# EAGLE design NESv21 (EAGLE 5.11)
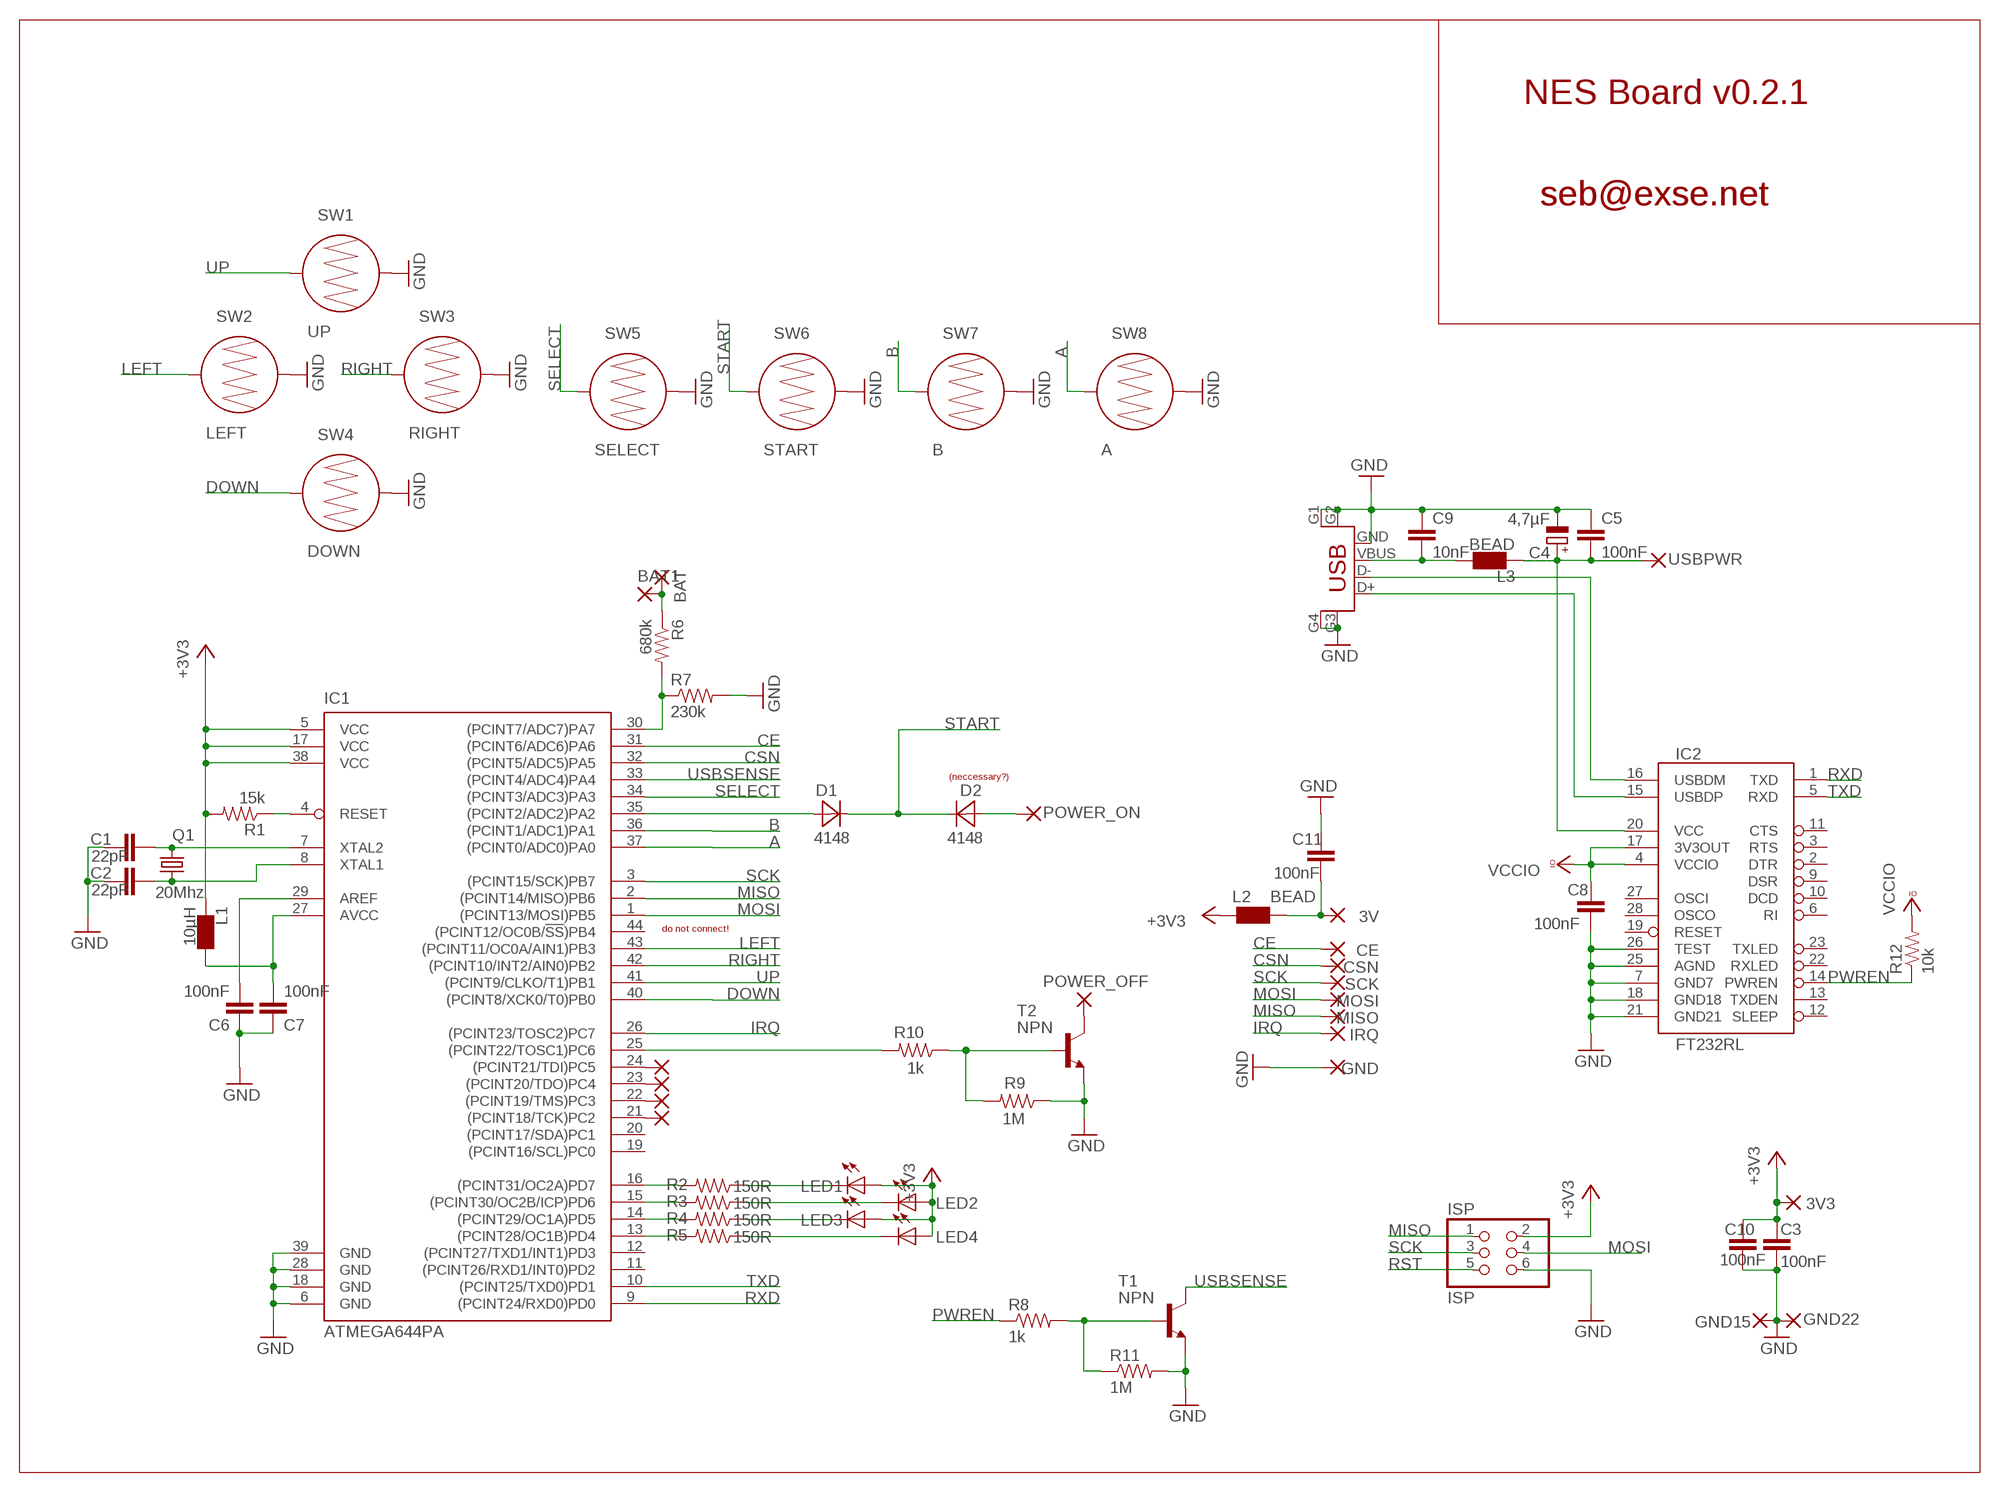
[diagram p0: schematic, sheet 1]

## Parts
3V  SMD2  [SMD1,27-2,54]
3V3  SMD2  [SMD1,27-2,54]
BAT  SMD2  [SMD1,27-2,54]
BAT1  SMD2  [SMD1,27-2,54]
C1  22pF  CAP0805  [0805]
C2  22pF  CAP0805  [0805]
C3  100nF  CAP0805  [0805]
C4  4,7µF  CPOL-EUSMCC  [SMC_C]
C5  100nF  CAP0805  [0805]
C6  100nF  CAP0805  [0805]
C7  100nF  CAP0805  [0805]
C8  100nF  CAP0805  [0805]
C9  10nF  CAP0805  [0805]
C10  100nF  CAP0805  [0805]
C11  100nF  CAP0805  [0805]
CE  SMD2  [SMD1,27-2,54]
CSN  SMD2  [SMD1,27-2,54]
D1  4148  DIODE_0805  [DIODE_0805]
D2  4148  DIODE_0805  [DIODE_0805]
GND  SMD2  [SMD1,27-2,54]
GND15  SMD2  [SMD1,27-2,54]
GND22  SMD2  [SMD1,27-2,54]
IC1  ATMEGA644PA  [TQFP44]
IC2  FT232RL  FT232RLSSOP  [SSOP28DB]
IRQ  SMD2  [SMD1,27-2,54]
ISP  ISP  PINHD-2X03_2.54  [2X03]
L1  10µH  L0805  [0805]
L2  BEAD  [0805]
L3  BEAD  [0805]
LED1  LED3MM  [LED3MM]
LED2  LED3MM  [LED3MM]
LED3  LED3MM  [LED3MM]
LED4  LED3MM  [LED3MM]
MISO  SMD2  [SMD1,27-2,54]
MOSI  SMD2  [SMD1,27-2,54]
PAD1  SMD2  [SMD1,27-2,54]
PAD2  SMD2  [SMD1,27-2,54]
PAD3  SMD2  [SMD1,27-2,54]
PAD4  SMD2  [SMD1,27-2,54]
POWER_OFF  SMD2  [SMD1,27-2,54]
POWER_ON  SMD2  [SMD1,27-2,54]
Q1  20Mhz  X22-OSCILLATOR  [X22]
R1  15k  RESISTOR0805-RES  [0805]
R2  150R  RESISTOR0805-RES  [0805]
R3  150R  RESISTOR0805-RES  [0805]
R4  150R  RESISTOR0805-RES  [0805]
R5  150R  RESISTOR0805-RES  [0805]
R6  680k  RESISTOR0805-RES  [0805]
R7  230k  RESISTOR0805-RES  [0805]
R8  1k  RESISTOR0805-RES  [0805]
R9  1M  RESISTOR0805-RES  [0805]
R10  1k  RESISTOR0805-RES  [0805]
R11  1M  RESISTOR0805-RES  [0805]
R12  10k  RESISTOR0805-RES  [0805]
SCK  SMD2  [SMD1,27-2,54]
SW1  UP  BUTTON-CONDUCTIVESMD  [BUTTON-CONDUCTIVE]
SW2  LEFT  BUTTON-CONDUCTIVESMD  [BUTTON-CONDUCTIVE]
SW3  RIGHT  BUTTON-CONDUCTIVESMD  [BUTTON-CONDUCTIVE]
SW4  DOWN  BUTTON-CONDUCTIVESMD  [BUTTON-CONDUCTIVE]
SW5  SELECT  BUTTON-CONDUCTIVESMD  [BUTTON-CONDUCTIVE]
SW6  START  BUTTON-CONDUCTIVESMD  [BUTTON-CONDUCTIVE]
SW7  B  BUTTON-CONDUCTIVESMD  [BUTTON-CONDUCTIVE]
SW8  A  BUTTON-CONDUCTIVESMD  [BUTTON-CONDUCTIVE]
T1  NPN  BC847  [SOT23]
T2  NPN  BC847  [SOT23]
USBPWR  SMD2  [SMD1,27-2,54]
X1  USB-SMD-NS  [USB-MINIB-NOSTOP]

## Nets
+3V3: 3V3.1(P) C3.1 C10.1 IC1.5(VCC) IC1.17(VCC) IC1.38(VCC) ISP.2 L1.2 L2.1 LED1.A LED2.A LED3.A LED4.A R1.2
+5V: C4.+ C5.2 IC2.20(VCC) L3.2 USBPWR.1(P)
A: IC1.37((PCINT0/ADC0)PA0) SW8.1
B: IC1.36((PCINT1/ADC1)PA1) SW7.1
CE: CE.1(P) IC1.31((PCINT6/ADC6)PA6)
CSN: CSN.1(P) IC1.32((PCINT5/ADC5)PA5)
DOWN: IC1.40((PCINT8/XCK0/T0)PB0) SW4.1
GND: C1.1 C2.1 C3.2 C4.- C5.1 C6.2 C7.2 C8.2 C9.1 C10.2 C11.1 GND15.1(P) GND22.1(P) GND.1(P) IC1.6(GND) IC1.18(GND) IC1.28(GND) IC1.39(GND) IC2.7(GND7) IC2.18(GND18) IC2.21(GND21) IC2.25(AGND) IC2.26(TEST) ISP.6 R7.2 R9.1 R11.2 SW1.2 SW2.2 SW3.2 SW4.2 SW5.2 SW6.2 SW7.2 SW8.2 T1.2(E) T2.2(E) X1.G1(GND) X1.G2(GND) X1.G3(GND) X1.G4(GND) X1.GND
IRQ: IC1.26((PCINT23/TOSC2)PC7) IRQ.1(P)
LEFT: IC1.43((PCINT11/OC0A/AIN1)PB3) SW2.1
MISO: IC1.2((PCINT14/MISO)PB6) ISP.1 MISO.1(P)
MOSI: IC1.1((PCINT13/MOSI)PB5) ISP.4 MOSI.1(P)
N$1: R9.2 R10.1 T2.1(B)
N$2: C2.2 IC1.8(XTAL1) Q1.1
N$3: C1.2 IC1.7(XTAL2) Q1.3
N$4: IC1.13((PCINT28/OC1B)PD4) R5.2
N$5: IC1.14((PCINT29/OC1A)PD5) R4.2
N$6: IC1.15((PCINT30/OC2B/ICP)PD6) R3.2
N$7: IC1.16((PCINT31/OC2A)PD7) R2.2
N$8: LED1.K(C) R2.1
N$9: LED2.K(C) R3.1
N$10: LED3.K(C) R4.1
N$11: LED4.K(C) R5.1
N$12: IC1.25((PCINT22/TOSC1)PC6) R10.2
N$13: C7.1 IC1.27(AVCC) L1.1
N$14: 3V.1(P) C11.2 L2.2
N$15: D1.2(A) IC1.35((PCINT2/ADC2)PA2)
N$16: BAT1.1(P) BAT.1(P) R6.1
N$17: IC1.30((PCINT7/ADC7)PA7) R6.2 R7.1
N$18: R8.2 R11.1 T1.1(B)
N$19: IC2.16(USBDM) X1.D-
N$20: C6.1 IC1.29(AREF)
N$21: C9.2 L3.1 X1.VBUS
N$22: IC2.15(USBDP) X1.D+
N$23: D2.2(A) POWER_ON.1(P)
N$25: IC1.24((PCINT21/TDI)PC5) PAD1.1(P)
N$26: IC1.23((PCINT20/TDO)PC4) PAD2.1(P)
N$27: IC1.22((PCINT19/TMS)PC3) PAD3.1(P)
N$28: IC1.21((PCINT18/TCK)PC2) PAD4.1(P)
PC5: POWER_OFF.1(P) T2.3(C)
PWREN: IC2.14(PWREN) R8.1 R12.1
RIGHT: IC1.42((PCINT10/INT2/AIN0)PB2) SW3.1
RST: IC1.4(RESET) ISP.5 R1.1
RXD: IC1.9((PCINT24/RXD0)PD0) IC2.1(TXD)
SCK: IC1.3((PCINT15/SCK)PB7) ISP.3 SCK.1(P)
SELECT: IC1.34((PCINT3/ADC3)PA3) SW5.1
START: D1.1(C) D2.1(C) SW6.1
TXD: IC1.10((PCINT25/TXD0)PD1) IC2.5(RXD)
UP: IC1.41((PCINT9/CLKO/T1)PB1) SW1.1
USBSENSE: IC1.33((PCINT4/ADC4)PA4) T1.3(C)
VCCIO: C8.1 IC2.4(VCCIO) IC2.17(3V3OUT) R12.2
Unconnected: IC1.11((PCINT26/RXD1/INT0)PD2) IC1.12((PCINT27/TXD1/INT1)PD3) IC1.19((PCINT16/SCL)PC0) IC1.20((PCINT17/SDA)PC1) IC1.44((PCINT12/OC0B/!SS!)PB4) IC2.2(DTR) IC2.3(RTS) IC2.6(RI) IC2.9(DSR) IC2.10(DCD) IC2.11(CTS) IC2.12(SLEEP) IC2.13(TXDEN) IC2.19(RESET) IC2.22(RXLED) IC2.23(TXLED) IC2.27(OSCI) IC2.28(OSCO)

## Notes on the sheet
- NES Board v0.2.1
- seb@exse.net | seb@exse.net
- (neccessary?)
- do not connect!

## Library data of the parts
3V 3V3 BAT BAT1 CE CSN GND GND15 GND22 IRQ MISO MOSI PAD1-PAD4 POWER_OFF POWER_ON SCK USBPWR = wirepad:SMD2: SMD PAD
C1-C3 C5-C11 = SparkFun:CAP: Capacitor Standard 0603 ceramic capacitor, and 0.1" leaded capacitor.
C4 = rcl:CPOL-EU: POLARIZED CAPACITOR, European symbol
D1 D2 = seb:DIODE_0805
IC1 = seb:ATMEGA644PA
IC2 = SparkFun:FT232RL: USB UART FT232RL 4th Generation USB UART (USB <-> Serial) Controller. Spark Fun Electronics SKU : COM-00650
ISP = pinhead-2:PINHD-2X03: PIN HEADER
L1 = seb:L0805
L2 L3 = seb:BEAD
LED1-LED4 = SparkFun:LED: LEDs Standard schematic elements and footprints for 5mm, 3mm, 1206, and 0603 sized LEDs. 5mm - Spark Fun Electronics SKU : COM-00529 (and others)
Q1 = seb:X22-OSCILLATOR
R1-R12 = SparkFun:RESISTOR: Resistor Basic schematic elements and footprints for 0603, 1206, and PTH resistors.
SW1-SW8 = SparkFun:BUTTON-CONDUCTIVE: Conductive Button Used with rubber key pads. This one was designed and proven to work with the PolyCase Key FOB enclosures.
T1 T2 = transistor:BC847: NPN TRANSISTOR
X1 = SparkFun:USB: USB Connectors USB-B-PTH is fully proven SKU : PRT-00139 USB-miniB is fully proven SKU : PRT-00587 USB-A-PCB is untested. USB-A-H is throughly reviewed, but untested. Spark Fun Electronics SKU : PRT-00437 USB-B-SMT is throughly reviewed, but untested. Needs silkscreen touching up. USB-A-S has not been used/tested USB-MB-H has not been used/tested

## Board
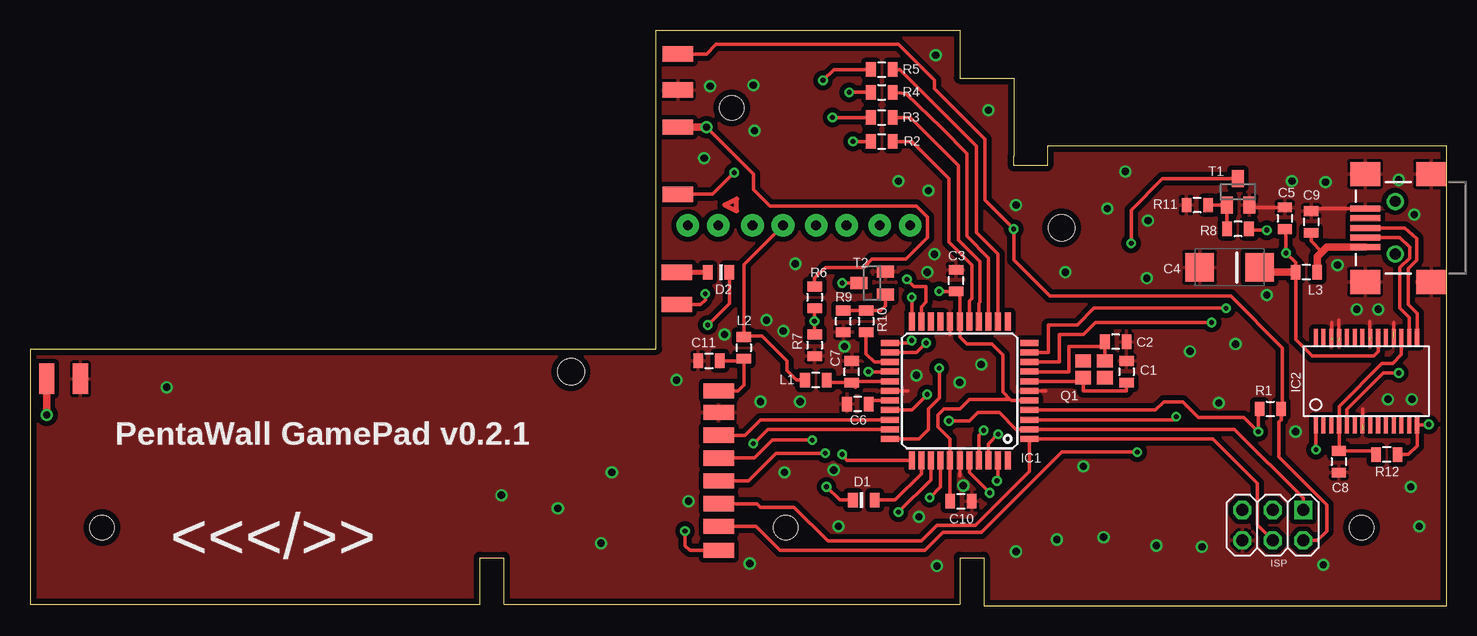
[diagram p1: board, top side]
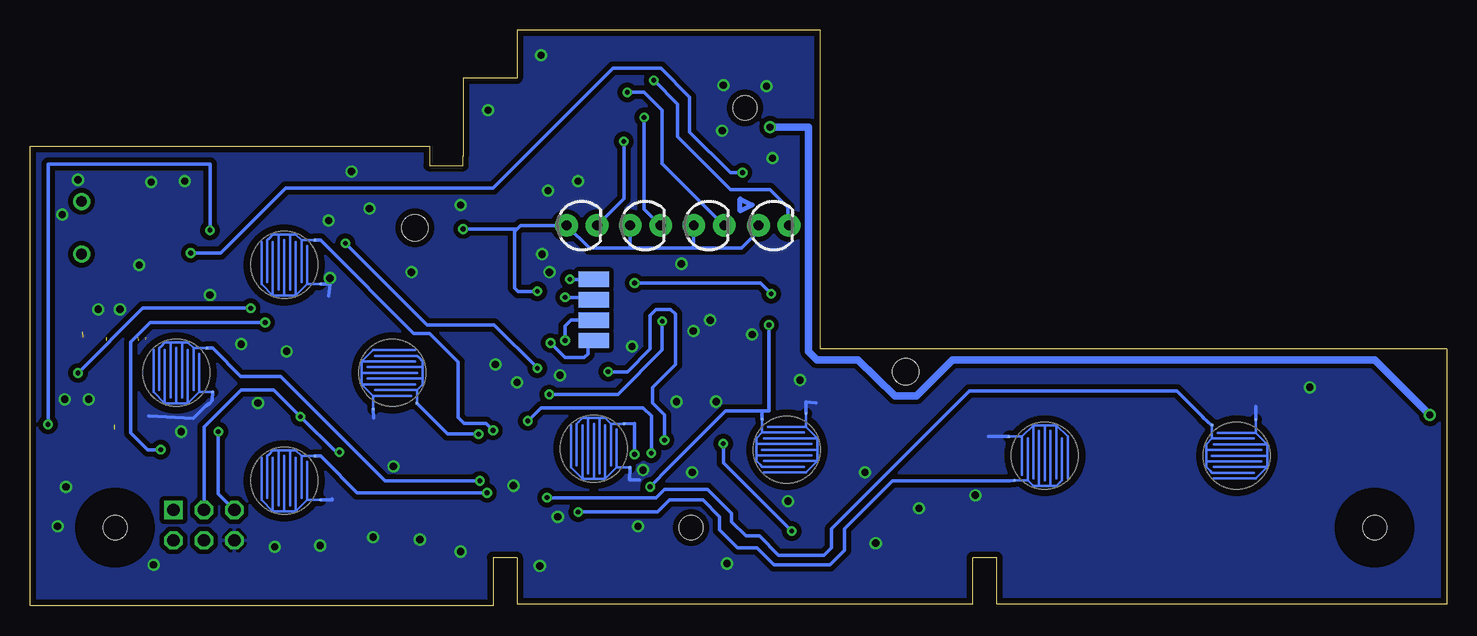
[diagram p2: board, bottom side, seen from below]

Size 118.1 x 48 mm. Coordinates in mm from the lower left corner, seen from the top.
Outline: 0,0.1 37.5,0.1 37.5,4 39.5,4 39.5,0.1 77.5,0.1 77.5,4 79.5,4 79.5,0 118.1,0 118.1,38.3 84.8,38.3 84.8,36.7 82,36.7 82,37.5 82,44 77.5,44 77.5,48 52.2,48 52.2,21.4 0,21.4 0,0.1
Copper layers (1*16): Top 0.035mm / dielectric 1.5mm / Bottom 0.035mm
Design rules "default *": minimum track width 10mil, minimum drill 0.3mm, track to track 8mil, track to pad 8mil, pad to pad 8mil, via to via 8mil, smd to smd 8mil, copper to edge 20mil, drill to drill 8mil, minimum pad ring 10mil, minimum via ring 8mil, stop-mask expansion 4mil, vias tented up to drill 0.6mm, thermal gap 10mil
Holes 2 mm at 6,6.5 63,6.5 111,6.5 58.5,41.5
Holes 2.2 mm at 86,31.5 45.1,19.5
tKeepout: area 93.3,16.4 to 99.3,22.4; area 21.6,11.5 to 27.6,17.5
bKeepout: area 61.6,5.1 to 64.4,7.9; area 57.1,40.1 to 59.9,42.9; area 43.7,18.2 to 46.5,21; area 84.4,30 to 87.2,32.8
tRestrict: 1 lines
bRestrict: area 109.6,5.1 to 112.4,7.9; area 4.6,5.1 to 7.4,7.9

### Footprints (pad centres in the part's own frame; a part is rotated, then mirrored left to right if it is on the bottom)
SMD1,27-2,54 = smd 1.27 x 2.54: 1 0,0
0805 = smd 0.8 x 1.2: 1 -0.9,0; 2 0.9,0
SMC_C = smd 2.4 x 2.4: + -2.5,0; - 2.5,0
DIODE_0805 = smd 0.8 x 1.2: 1 -0.9,0; 2 0.9,0
TQFP44 = smd 1.5 x 0.5: 1 -5.8,4; 2 -5.8,3.2; 3 -5.8,2.4; 4 -5.8,1.6; 5 -5.8,0.8; 6 -5.8,0; 7 -5.8,-0.8; 8 -5.8,-1.6; 9 -5.8,-2.4; 10 -5.8,-3.2; 11 -5.8,-4; 23 5.8,-4; 24 5.8,-3.2; 25 5.8,-2.4; 26 5.8,-1.6; 27 5.8,-0.8; 28 5.8,0; 29 5.8,0.8; 30 5.8,1.6; 31 5.8,2.4; 32 5.8,3.2; 33 5.8,4 | smd 0.5 x 1.5: 12 -4,-5.8; 13 -3.2,-5.8; 14 -2.4,-5.8; 15 -1.6,-5.8; 16 -0.8,-5.8; 17 0,-5.8; 18 0.8,-5.8; 19 1.6,-5.8; 20 2.4,-5.8; 21 3.2,-5.8; 22 4,-5.8; 34 4,5.8; 35 3.2,5.8; 36 2.4,5.8; 37 1.6,5.8; 38 0.8,5.8; 39 0,5.8; 40 -0.8,5.8; 41 -1.6,5.8; 42 -2.4,5.8; 43 -3.2,5.8; 44 -4,5.8
SSOP28DB = smd 0.348 x 1.397: 1 -4.225,-3.656; 2 -3.575,-3.656; 3 -2.925,-3.656; 4 -2.275,-3.656; 5 -1.625,-3.656; 6 -0.975,-3.656; 7 -0.325,-3.656; 8 0.325,-3.656; 9 0.975,-3.656; 10 1.625,-3.656; 11 2.275,-3.656; 12 2.925,-3.656; 13 3.575,-3.656; 14 4.225,-3.656; 15 4.225,3.656; 16 3.575,3.656; 17 2.925,3.656; 18 2.275,3.656; 19 1.625,3.656; 20 0.975,3.656; 21 0.325,3.656; 22 -0.325,3.656; 23 -0.975,3.656; 24 -1.625,3.656; 25 -2.275,3.656; 26 -2.925,3.656; 27 -3.575,3.656; 28 -4.225,3.656
2X03 = drill 1.016 square: 1 -2.54,-1.27 | drill 1.016 octagon: 2 -2.54,1.27; 3 0,-1.27; 4 0,1.27; 5 2.54,-1.27; 6 2.54,1.27
LED3MM = drill 0.813 pad 1.88 round: A -1.27,0; K 1.27,0
X22 = smd 1.3 x 1.1: 1 0.9,0.7; 2 -0.9,0.7; 3 -0.9,-0.7; 4 0.9,-0.7
BUTTON-CONDUCTIVE = smd 0.203 x 0.203: 1 2.54,2.064; 2 3.016,-1.587
SOT23 = smd 1 x 1.4: 1 -0.95,-1.1; 2 0.95,-1.1; 3 0,1.1
USB-MINIB-NOSTOP = smd 2.5 x 0.5: D+ 2.5,0; D- 2.5,0.8; GND 2.5,-1.6; ID 2.5,-0.8; VBUS 2.5,1.6 | smd 2.5 x 2: G1 -3,-4.5; G2 -3,4.5; G3 2.5,4.5; G4 2.5,-4.5 | drill 0.9 pad 0.8 round: H1 0,2.2 | drill 0.9 pad 0.787 round: H2 0,-2.2

### Placement (x,y rotation side)
3V  57.4,17.9 90 top
3V3  54,46 90 top
BAT  54,39.9 90 top
BAT1  1.4,18.9 0 top
C1  91.4,19.5 270 top
C2  90.5,22 180 top
C3  77.2,27.1 90 top
C4  100,28.2 180 top
C5  104.6,32.3 270 top
C6  69,16.8 180 top
C7  68.5,19.5 90 top
C8  109.1,12 270 top
C9  106.8,32 270 top
C10  77.6,8.7 0 top
C11  56.6,20.4 0 top
CE  57.4,14.2 90 top
CSN  57.4,4.6 90 top
D1  69.5,8.8 0 top
D2  57.4,27.8 180 top
GND  57.4,16.1 90 top
GND15  54,43 90 top
GND22  4.2,18.9 0 top
IC1  77.5,17.9 180 top
IC2  111.4,18.7 0 top
IRQ  57.4,12.3 90 top
ISP  103.6,6.7 180 top
L1  65.5,18.8 180 top
L2  59.5,21.5 270 top
L3  106.4,27.8 180 top
LED1  72.1,31.7 0 bottom
LED2  66.8,31.7 0 bottom
LED3  61.5,31.7 0 bottom
LED4  56.1,31.7 0 bottom
MISO  57.4,10.4 90 top
MOSI  57.4,8.5 90 top
PAD1  71.1,22.1 90 bottom
PAD2  71.1,23.8 90 bottom
PAD3  71.1,25.5 90 bottom
PAD4  71.1,27.2 90 bottom
POWER_OFF  53.9,25.1 90 top
POWER_ON  53.9,27.8 270 top
Q1  88.7,19.7 0 top
R1  103.4,16.4 0 top
R2  71,38.7 0 top
R3  71,40.7 0 top
R4  71,42.8 0 top
R5  71,44.7 0 top
R6  65.4,25.7 270 top
R7  65.4,21.7 270 top
R8  100.7,31.4 180 top
R9  67.8,23.7 90 top
R10  69.7,23.7 270 top
R11  97.3,33.4 180 top
R12  113.1,12.6 180 top
SCK  57.4,6.6 90 top
SW1  96.9,28.4 0 bottom
SW2  105.9,19.4 0 bottom
SW3  87.9,19.4 270 bottom
SW4  96.9,10.4 0 bottom
SW5  71.1,13.1 0 bottom
SW6  55,13 90 bottom
SW7  33.5,12.5 180 bottom
SW8  17.5,12.5 90 bottom
T1  100.7,34.5 0 top
T2  70.2,26.9 90 top
USBPWR  54,34.3 270 top
X1  113.8,31.5 180 top

### Tracks (layer width: path | path; a pad name or v marks a point on that pad's centre or on a via)
+3V3  (via drill 0.4)
  Top 0.305: 3V3.1 56.4,46 57.2,46.8 72.4,46.8 75.4,43.8 75.4,43.1 79.6,38.9 79.6,33.8 v82,31.4 82,28.8 85,25.8 100.1,25.8 104.4,21.5 104.4,16.5 R1.2 | ISP.2 107.33,5.43 108.1,6.2 108.1,8.4 104.1,12.4 104.1,15.3 104.3,15.5 R1.2 | v75.8,26.2 C3.1 77.5,25.9 IC1.17 77.5,22.4 78.1,21.8 80.2,21.8 81.1,20.9 81.1,17.8 81.7,17.2 | R1.2 104.4,16.4 | IC1.5 81.8,17.1 81.7,17.2 | LED3.A 59.5,28.43 L2.1 59.52,22.5 61,22.5 63.1,20.4 63.1,19.6 63.9,18.8 L1.2 | 81.7,17.2 78.3,17.2 77.5,16.4 76.2,16.4 75.7,15.9 75.7,14.9 76.7,13.9 IC1.38 C10.1
  Bottom 0.305: 68.1,29.8 71.47,29.8 LED1.A 77.2,31.7 77.5,31.4 | 62.8,29.8 68.1,29.8 | 62.8,29.8 58.8,29.8 57.37,31.23 LED4.A | LED3.A 62.8,31.33 62.8,29.8 | LED2.A 68.1,31.37 68.1,29.8 | 77.5,31.4 v82,31.4 82,31.5 | v75.8,26.2 77.4,26.2 77.7,26.5 77.7,31.2 77.5,31.4
+5V  (via drill 0.4)
  Top 0.305: C5.2 104.7,31.3 v104.7,29.4 105.5,28.6 L3.2 105.5,22.2 106.9,20.8 112,20.8 112.38,21.18 IC2.20 | USBPWR.1 56.9,34.3 v58.7,36.1
  Top 0.61: C4.+ 102.9,27.8 L3.2
  Bottom 0.305: v58.7,36.1 59.7,36.1 63.1,39.5 63.1,42.4 65.5,44.8 69.5,44.8 79.5,34.8 96.8,34.8 102.2,29.4 v104.7,29.4
A  (via drill 0.4)
  Top 0.305: v75,9 75.9,9.9 IC1.37
  Bottom 0.305: SW8.1 20.32,15.7 20.3,15.7 22.5,17.9 39.8,17.9 51.3,6.4 51.3,4.8 51.9,4.2 55.7,4.2 57.3,5.8 58.4,5.8 59.6,7 59.6,7.7 61.6,9.7 65.2,9.7 65.9,9 v75,9
B  (via drill 0.4)
  Top 0.305: IC1.36 75.1,10.5 v72.4,7.8
  Bottom 0.305: SW7.1 36.42,10.4 46.2,10.4 50.2,6.4 50.2,4.6 51.4,3.4 56.1,3.4 57.5,4.8 59.1,4.8 60.6,6.3 60.6,7.4 62,8.8 64.8,8.8 65.8,7.8 v72.4,7.8
CE
  Top 0.305: IC1.31 60.9,15.5 59.6,14.2 CE.1
CSN  (via drill 0.4)
  Top 0.305: IC1.32 61.5,14.7 v60.3,13.5 | v54.6,6.2 54.6,5 55,4.6 CSN.1
  Bottom 0.305: v60.3,13.5 60.3,11.9 v54.6,6.2
DOWN  (via drill 0.4)
  Top 0.305: IC1.40 78.3,11.1 v80,9.4
  Bottom 0.305: SW4.1 93.86,12.46 93.6,12.2 90.82,9.4 v80,9.4
GND  (via drill 0.6)  (5 unrouted)
  Top 0.305: 107.1,33.1 X1.GND | C5.1 101.65,33.2 T1.2 | 71.6,17.9 IC1.28 73.2,17.9 | 76.7,23.9 IC1.18 76.7,22.6 | IC1.6 84.7,17.9 | IC1.39 77.5,10.8 | 108.5,22.2 108.5,23.6 | 109.1,22.1 109.1,23.8 | 111.7,22.1 111.7,23.7 | 113.7,22.8 113.7,23.6 | 111.1,14.7 111.1,16.4
  Bottom 0.305: SW4.2 92.92,8.8 92.9,8.9 | SW1.2 93.1,26.8 93.2,25.8 | SW5.2 68.12,10.5 67.3,10.5 | SW6.2 53.4,17 52.6,16.9 | SW7.2 38.2,14.1 38.1,14.1 | SW8.2 15.9,16.1 15.9,16.6 | 89.44,15.66 SW3.2 | SW2.2 102.9,17.1 103.14,16.86 103.44,16.66 104.5,15.6 108.2,15.8
  other vias: 54.9,8.7 97.7,4.9 105.2,35.4 87.8,11.6 79.3,20.1 115.8,6.6 60.3,43.4 91.3,36.2 108,35.3 115.2,17.2 105.5,14.5 74.8,27.8 93.9,5 73.9,19.2 63.8,28.5 11.4,18.2 82.2,4.5 107.8,3.4 93.2,32.1 112.4,24.7 96.7,21.2 77.5,18.6 60.4,39.6 48.5,11.1 85.6,5.5 99.1,16.9 47.6,5.2 89.5,5.7 115.1,9.9 57.9,22.6 93.1,27.3 39.3,9.2 75.4,29.3 60.9,17 64.2,17 44,8.1 53.9,18.8 75.5,45.9 56.7,43.3 56.2,37.3 74.9,34.6 62.8,22.9 82.2,33.4 72.4,35.4 110.6,24.7 100.5,21.8 77.8,10 89.8,33.1 86.3,27.8 67,11.3 62.9,11.1 75.6,3.3 60,3.5 67.4,6.6 61.4,23.8 113.2,17.2 79.9,41.3 103.1,25.9 74.1,7.4 67.9,21.6 109,28.4 115.4,32.6 114.1,35.5
  pour Top (isolate 0.4): 118.3,-0.1 118.3,48.1 -0.1,48.1 -0.1,-0.1
  pour Bottom (isolate 0.4): 118.2,-0.1 118.1,48.2 -0.3,48.3 -0.2,0
IRQ  (via drill 0.4)
  Top 0.305: IRQ.1 60.4,12.3 61.9,13.8 v65.2,13.8 | v69.9,19.5 IC1.26
  Bottom 0.305: v69.9,19.5 68.3,19.5 66.4,21.4 66.4,24.2 65.9,24.7 64.7,24.7 64.3,24.3 64.3,20.1 66.2,18.2 66.2,16.9 65.2,15.9 v65.2,13.8
LEFT  (via drill 0.4)
  Top 0.305: v80.6,10.4 80.7,10.5 IC1.43
  Bottom 0.305: v80.6,10.4 88.5,10.4 97.2,19.1 100.52,19.1 102.8,21.4 102.86,21.46 SW2.1
MISO  (via drill 0.4)
  Top 0.305: v66.3,12.7 62.2,12.7 59.9,10.4 MISO.1 | ISP.1 106.14,8.96 100.4,14.7 IC1.2 82.2,14.7 80.8,16.1 79,16.1 78.3,15.4 v76.6,15.4
  Bottom 0.305: v66.3,12.7 66.3,15.8 67,16.5 75.5,16.5 v76.6,15.4
MOSI
  Top 0.305: MOSI.1 60.6,8.5 60.9,8.2 63.7,8.2 66.5,5.4 74.3,5.4 75.6,6.7 78.8,6.7 83.3,11.2 IC1.1 98.6,13.9 102.3,10.2 102.3,6.73 ISP.4
N$1
  Top 0.305: T2.1 71.3,25 70.9,24.6 R10.1 R9.2
N$2
  Top 0.305: IC1.8 86.6,19.5 86.6,21.6 89.2,21.6 C2.2 Q1.1
N$3
  Top 0.305: IC1.7 87.6,18.7 Q1.3 87.8,17.9 91.4,17.9 C1.2
N$4
  Top 0.305: R5.2 72.5,44.7 78.9,38.3 78.9,31.1 80.7,29.3 IC1.13
N$5
  Top 0.305: R4.2 73,42.7 76,39.8 78.1,37.7 78.1,30.8 79.9,29 IC1.14
N$6
  Top 0.305: R3.2 73.4,40.7 77.4,36.7 77.4,30.5 79.2,28.7 79.2,25.3 79.1,25.2 IC1.15
N$7
  Top 0.305: R2.2 73.5,38.7 76.6,35.6 76.6,30.3 78.5,28.4 78.5,25.6 78.3,25.4 IC1.16
N$8  (via drill 0.4)
  Top 0.305: v68.6,38.7 R2.1
  Bottom 0.305: LED1.K 68.6,33.93 v68.6,38.7
N$9  (via drill 0.4)
  Top 0.305: v66.9,40.7 R3.1
  Bottom 0.305: LED2.K 66.9,33.07 v66.9,40.7
N$10  (via drill 0.4)
  Top 0.305: v68.3,42.8 R4.1
  Bottom 0.305: LED3.K 65.4,36.87 65.4,41.3 66.9,42.8 v68.3,42.8
N$11  (via drill 0.4)
  Top 0.305: R5.1 67,44.7 v66.1,43.8
  Bottom 0.305: LED4.K 54.9,31.57 54.9,33.2 56.4,34.7 59.7,34.7 64.1,39.1 64.1,41.8 v66.1,43.8
N$12
  Top 0.305: R10.2 69.7,21 70.4,20.3 IC1.25
N$13
  Top 0.305: C7.1 69,18.7 | 69,18.7 68.8,18.7 C7.1 | 69,18.7 IC1.27 | C7.1 68.8,18.2 | L1.1 66.6,18.6 C7.1
N$14
  Top 0.305: 3V.1 59,17.9 59.5,18.4 L2.2 59.42,20.4 C11.2
N$15
  Top 0.305: D1.2 72.1,8.8 74.3,11 IC1.35
N$16  (via drill 0.6)
  Top 0.305: R6.1 65.4,27.3 66.3,28.2 69.5,28.2 70.2,28.9 73,28.9 74.8,30.7 74.8,32.4 73.9,33.3 61.7,33.3 60.3,34.7 60.3,36 v56.4,39.9
  Top 0.61: v1.4,15.9 BAT1.1 | v56.4,39.9 BAT.1
  Bottom 0.61: v1.4,15.9 6,20.5 41.2,20.5 44.2,17.5 46,17.5 49.1,20.5 52.5,20.5 53.2,21.2 53.2,39.9 v56.4,39.9
N$17  (via drill 0.4)
  Top 0.305: R6.2 R7.1 v65.4,23.7 | IC1.30 73.5,16.3 v74.8,17.6
  Bottom 0.305: v74.8,17.6 69.1,17.6 65.4,21.3 R7.1 v65.4,23.7
N$18
  Top 0.305: R8.2 99.75,31 T1.1 R11.1
N$19
  Top 0.305: IC2.16 114.97,24.03 114.2,24.8 114.2,28.2 115,29 115,29.9 114.2,30.7 X1.D-
N$20
  Top 0.305: IC1.29 70.2,17.1 C6.1
N$21
  Top 0.305: C9.2 106.8,30.4 107.7,29.5
  Top 0.61: X1.VBUS 108.1,29.9 107.7,29.5 107.3,29.1 L3.1
N$22
  Top 0.305: IC2.15 115.62,24.38 114.9,25.1 114.9,28.1 115.6,28.8 115.6,30.6 114.6,31.5 X1.D+
N$23
  Top 0.406: POWER_ON.1 D2.2
N$24
  Top 0.406: 58.9,32.9 58.9,33.9 57.9,33.4 58.9,32.9
N$25  (via drill 0.4)
  Top 0.305: IC1.24 73.9,21.1 v74.7,21.9
  Bottom 0.305: v74.7,21.9 73.5,20.7 71.9,20.7 71.6,21 71.6,21.6 PAD1.1
N$26  (via drill 0.4)
  Top 0.305: IC1.23 73.3,21.9 v73.5,22.1
  Bottom 0.305: v73.5,22.1 73.5,23.3 73,23.8 PAD2.1
N$27  (via drill 0.4)
  Top 0.305: v73.5,25.7 IC1.22
  Bottom 0.305: v73.5,25.7 71.3,25.7 PAD3.1
N$28  (via drill 0.4)
  Top 0.305: IC1.21 74.3,24.9 74.7,25.3 74.7,26.6 73.7,26.6 v73.1,27.2
  Bottom 0.305: PAD4.1 v73.1,27.2
N$29
  Bottom 0.406: 58.9,32.9 57.9,33.4 58.9,33.9 58.9,32.9
PC5  (via drill 0.4)
  Top 0.305: v67.7,26.9 T2.3 | POWER_OFF.1 55.9,25.1 56.3,25.5 v56.3,26
  Bottom 0.305: v56.3,26 57.2,26.9 v67.7,26.9
PWREN  (via drill 0.4)
  Top 0.305: R12.1 114.9,12.6 115.62,13.32 IC2.14 116.7,15.04 v116.6,15.1 | v103.1,31.3 101.6,31.3 R8.1
  Bottom 0.305: v116.6,15.1 116.6,36.8 103.1,36.8 v103.1,31.3
RIGHT  (via drill 0.4)
  Top 0.305: v80.7,14.3 79.9,13.5 IC1.42
  Bottom 0.305: v80.7,14.3 83,14.3 83.28,14.3 SW3.1
RST  (via drill 0.4)
  Top 0.305: IC1.4 93.8,16.3 94.5,17 96.1,17 97.4,15.7 101.2,15.7 v102.4,14.5 102.4,16.4 R1.1
  Bottom 0.305: ISP.5 102.4,9.31 v102.4,14.5
RXD  (via drill 0.4)
  Top 0.305: IC1.9 85.8,20.3 85.8,22.6 87.8,22.6 88.8,23.6 v98.5,23.6 | v107.2,13 107.17,13.03 IC2.1
  Bottom 0.305: v98.5,23.6 108.1,23.6 109.7,22 109.7,14.4 108.3,13 v107.2,13
SCK  (via drill 0.4)
  Top 0.305: v92.3,12.8 86,12.8 79.3,6.1 76.1,6.1 74.6,4.6 62.5,4.6 60.5,6.6 SCK.1 | IC1.3 95.3,15.5 v95.55,15.75
  Bottom 0.305: v92.3,12.8 92.6,12.8 v95.55,15.75 97.8,18 100.5,18 103.6,14.9 ISP.3
SELECT  (via drill 0.4)
  Top 0.305: IC1.34 68.1,12.1 v67.7,12.6
  Bottom 0.305: v67.7,12.6 67.7,15.18 SW5.1
START  (via drill 0.4)
  Top 0.305: D2.1 58.3,25.2 v56.5,23.4 | D1.1 67.5,8.8 v66.4,9.9
  Bottom 0.305: v66.4,9.9 64.7,11.64 60.1,16.24 57,16.24 | 56.5,16.24 56.5,16.3 | 57,16.24 56.5,16.24 | 56.5,16.24 56.5,16.3 | 56.5,16.3 v56.5,23.4 | SW6.1 57.06,16.18 57,16.24
TXD  (via drill 0.4)
  Top 0.305: IC1.10 84.9,21.1 84.9,23.4 87.3,23.4 88.7,24.8 v99.7,24.8 | v114.1,19.4 112.8,19.4 109.78,16.38 IC2.5
  Bottom 0.305: v99.7,24.8 108.7,24.8 v114.1,19.4
UP  (via drill 0.4)
  Top 0.305: v79.5,14.6 79.1,14.2 IC1.41
  Bottom 0.305: SW1.1 93.86,30.46 93.6,30.2 86.12,22.7 84.8,22.7 82.4,20.3 82.4,15.7 81.9,15.2 80.1,15.2 v79.5,14.6
USBSENSE  (via drill 0.4)
  Top 0.305: v91.8,30.2 91.8,33 94.4,35.6 T1.3 | v75.8,19.8 75.8,17.3 74.9,16.4 74.9,14.7 74.1,13.9 IC1.33
  Bottom 0.305: v91.8,30.2 85,23.4 79.4,23.4 v75.8,19.8
VCCIO
  Top 0.305: IC2.17 114.33,20.93 113.6,20.2 112.7,20.2 109.12,16.62 IC2.4 109.12,12.92 C8.1 111.9,12.9 R12.2

### Text on the board
tNames: Q1 | PentaWall GamePad v0.2.1 | <<</>>
tStop: 3V3 | GND | BAT | USB5V | ON | OFF | 3V | GND | CE | BAT | GND | IRQ | seb@exse.net | MISO | MOSI | SCK | <<</>> | CSN
bStop: <<</>> | seb@exse.net
tDocu: Vout | GND | Vbat | GND | Vin | GND | ON_SW | OFF_SW